# EAGLE design tdt_rereference (EAGLE 8.1.0)

## Sheet 1 of 2
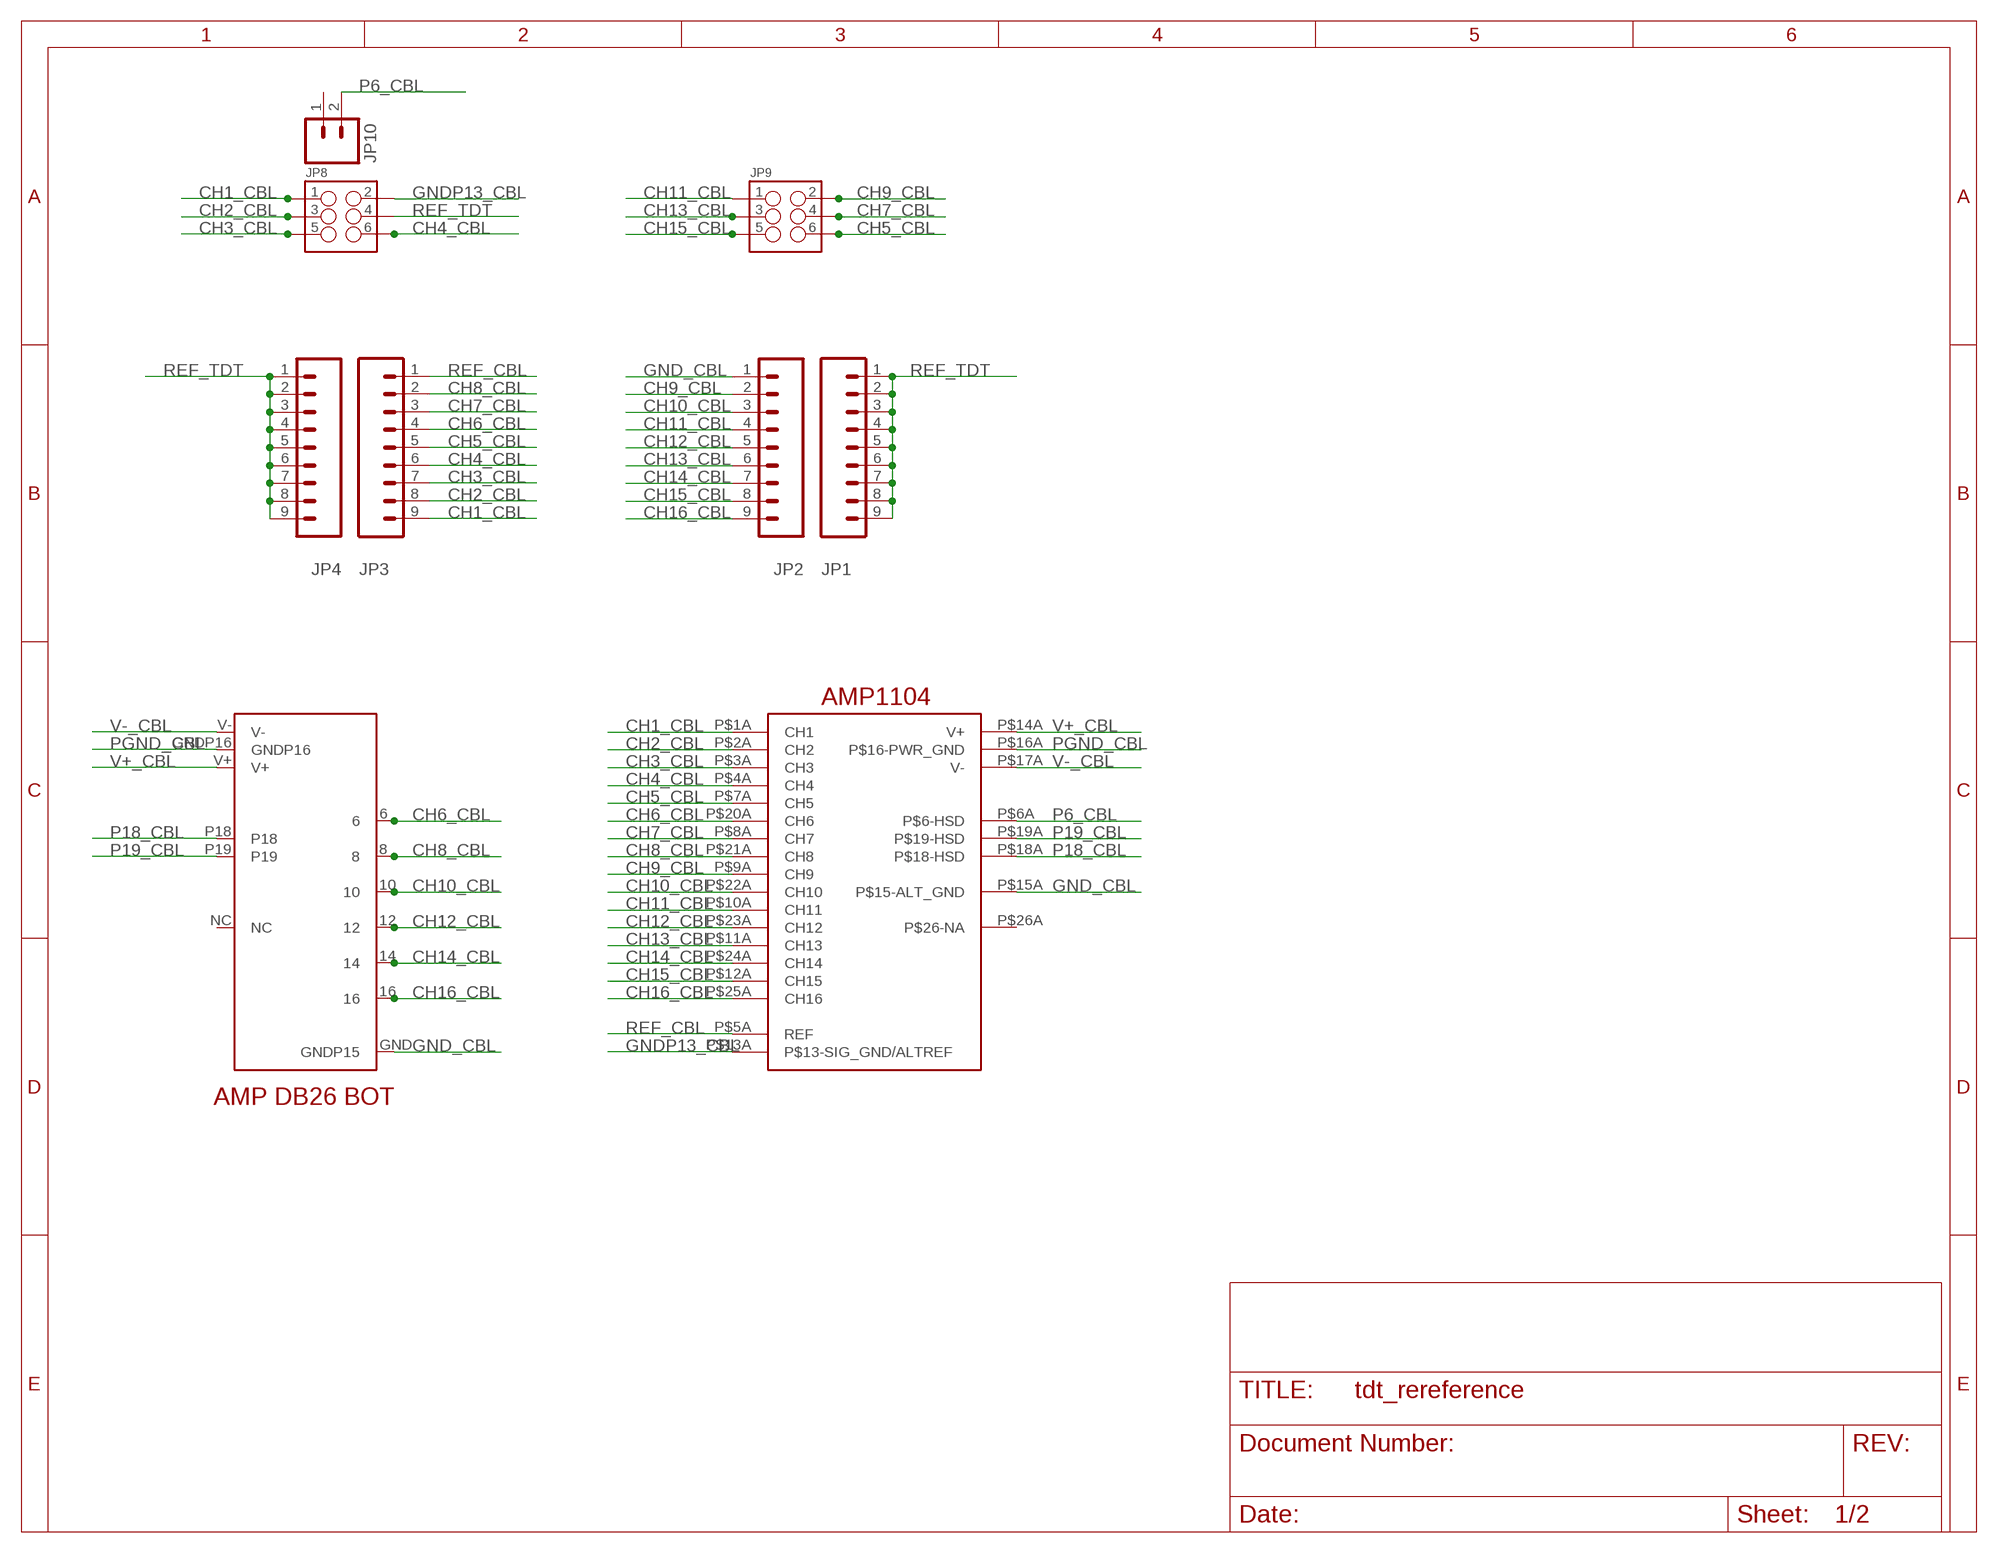
[diagram p0: schematic, sheet 1]

### Parts
JP1  M09  [1X09]
JP2  M09  [1X09]
JP3  M09  [1X09]
JP4  M09  [1X09]
JP8  M03X22X3_SILK_MALE_PTH  [2X3]
JP9  M03X22X3_SILK_MALE_PTH  [2X3]
JP10  M02PTH  [1X02]
U$1  DB26-MALE-BOT  [DB26-MALE-BOT]
U$3  AMP1104  [AMP1104]

### Nets
CH1_CBL: JP3.9 JP8.1 U$3.P$1A(CH1)
CH2_CBL: JP3.8 JP8.3 U$3.P$2A(CH2)
CH3_CBL: JP3.7 JP8.5 U$3.P$3A(CH3)
CH4_CBL: JP3.6 JP8.6 U$3.P$4A(CH4)
CH5_CBL: JP3.5 JP9.6 U$3.P$7A(CH5)
CH6_CBL: JP3.4 U$1.6 U$3.P$20A(CH6)
CH7_CBL: JP3.3 JP9.4 U$3.P$8A(CH7)
CH8_CBL: JP3.2 U$1.8 U$3.P$21A(CH8)
CH9_CBL: JP2.2 JP9.2 U$3.P$9A(CH9)
CH10_CBL: JP2.3 U$1.10 U$3.P$22A(CH10)
CH11_CBL: JP2.4 JP9.1 U$3.P$10A(CH11)
CH12_CBL: JP2.5 U$1.12 U$3.P$23A(CH12)
CH13_CBL: JP2.6 JP9.3 U$3.P$11A(CH13)
CH14_CBL: JP2.7 U$1.14 U$3.P$24A(CH14)
CH15_CBL: JP2.8 JP9.5 U$3.P$12A(CH15)
CH16_CBL: JP2.9 U$1.16 U$3.P$25A(CH16)
GND_CBL: JP2.1 U$1.GND(GNDP15) U$3.P$15A(P$15-ALT_GND)
GNDP13_CBL: JP8.2 U$3.P$13A(P$13-SIG_GND/ALTREF)
P6_CBL: JP10.2 U$3.P$6A(P$6-HSD)
P18_CBL: U$1.P18 U$3.P$18A(P$18-HSD)
P19_CBL: U$1.P19 U$3.P$19A(P$19-HSD)
PGND_CBL: U$1.GNDP16 U$3.P$16A(P$16-PWR_GND)
REF_CBL: JP3.1 U$3.P$5A(REF)
REF_TDT: JP1.1 JP1.2 JP1.3 JP1.4 JP1.5 JP1.6 JP1.7 JP1.8 JP1.9 JP4.1 JP4.2 JP4.3 JP4.4 JP4.5 JP4.6 JP4.7 JP4.8 JP4.9 JP8.4
V+_CBL: U$1.V+ U$3.P$14A(V+)
V-_CBL: U$1.V- U$3.P$17A(V-)
Unconnected: JP10.1 U$1.NC U$3.P$26A(P$26-NA)

## Sheet 2 of 2
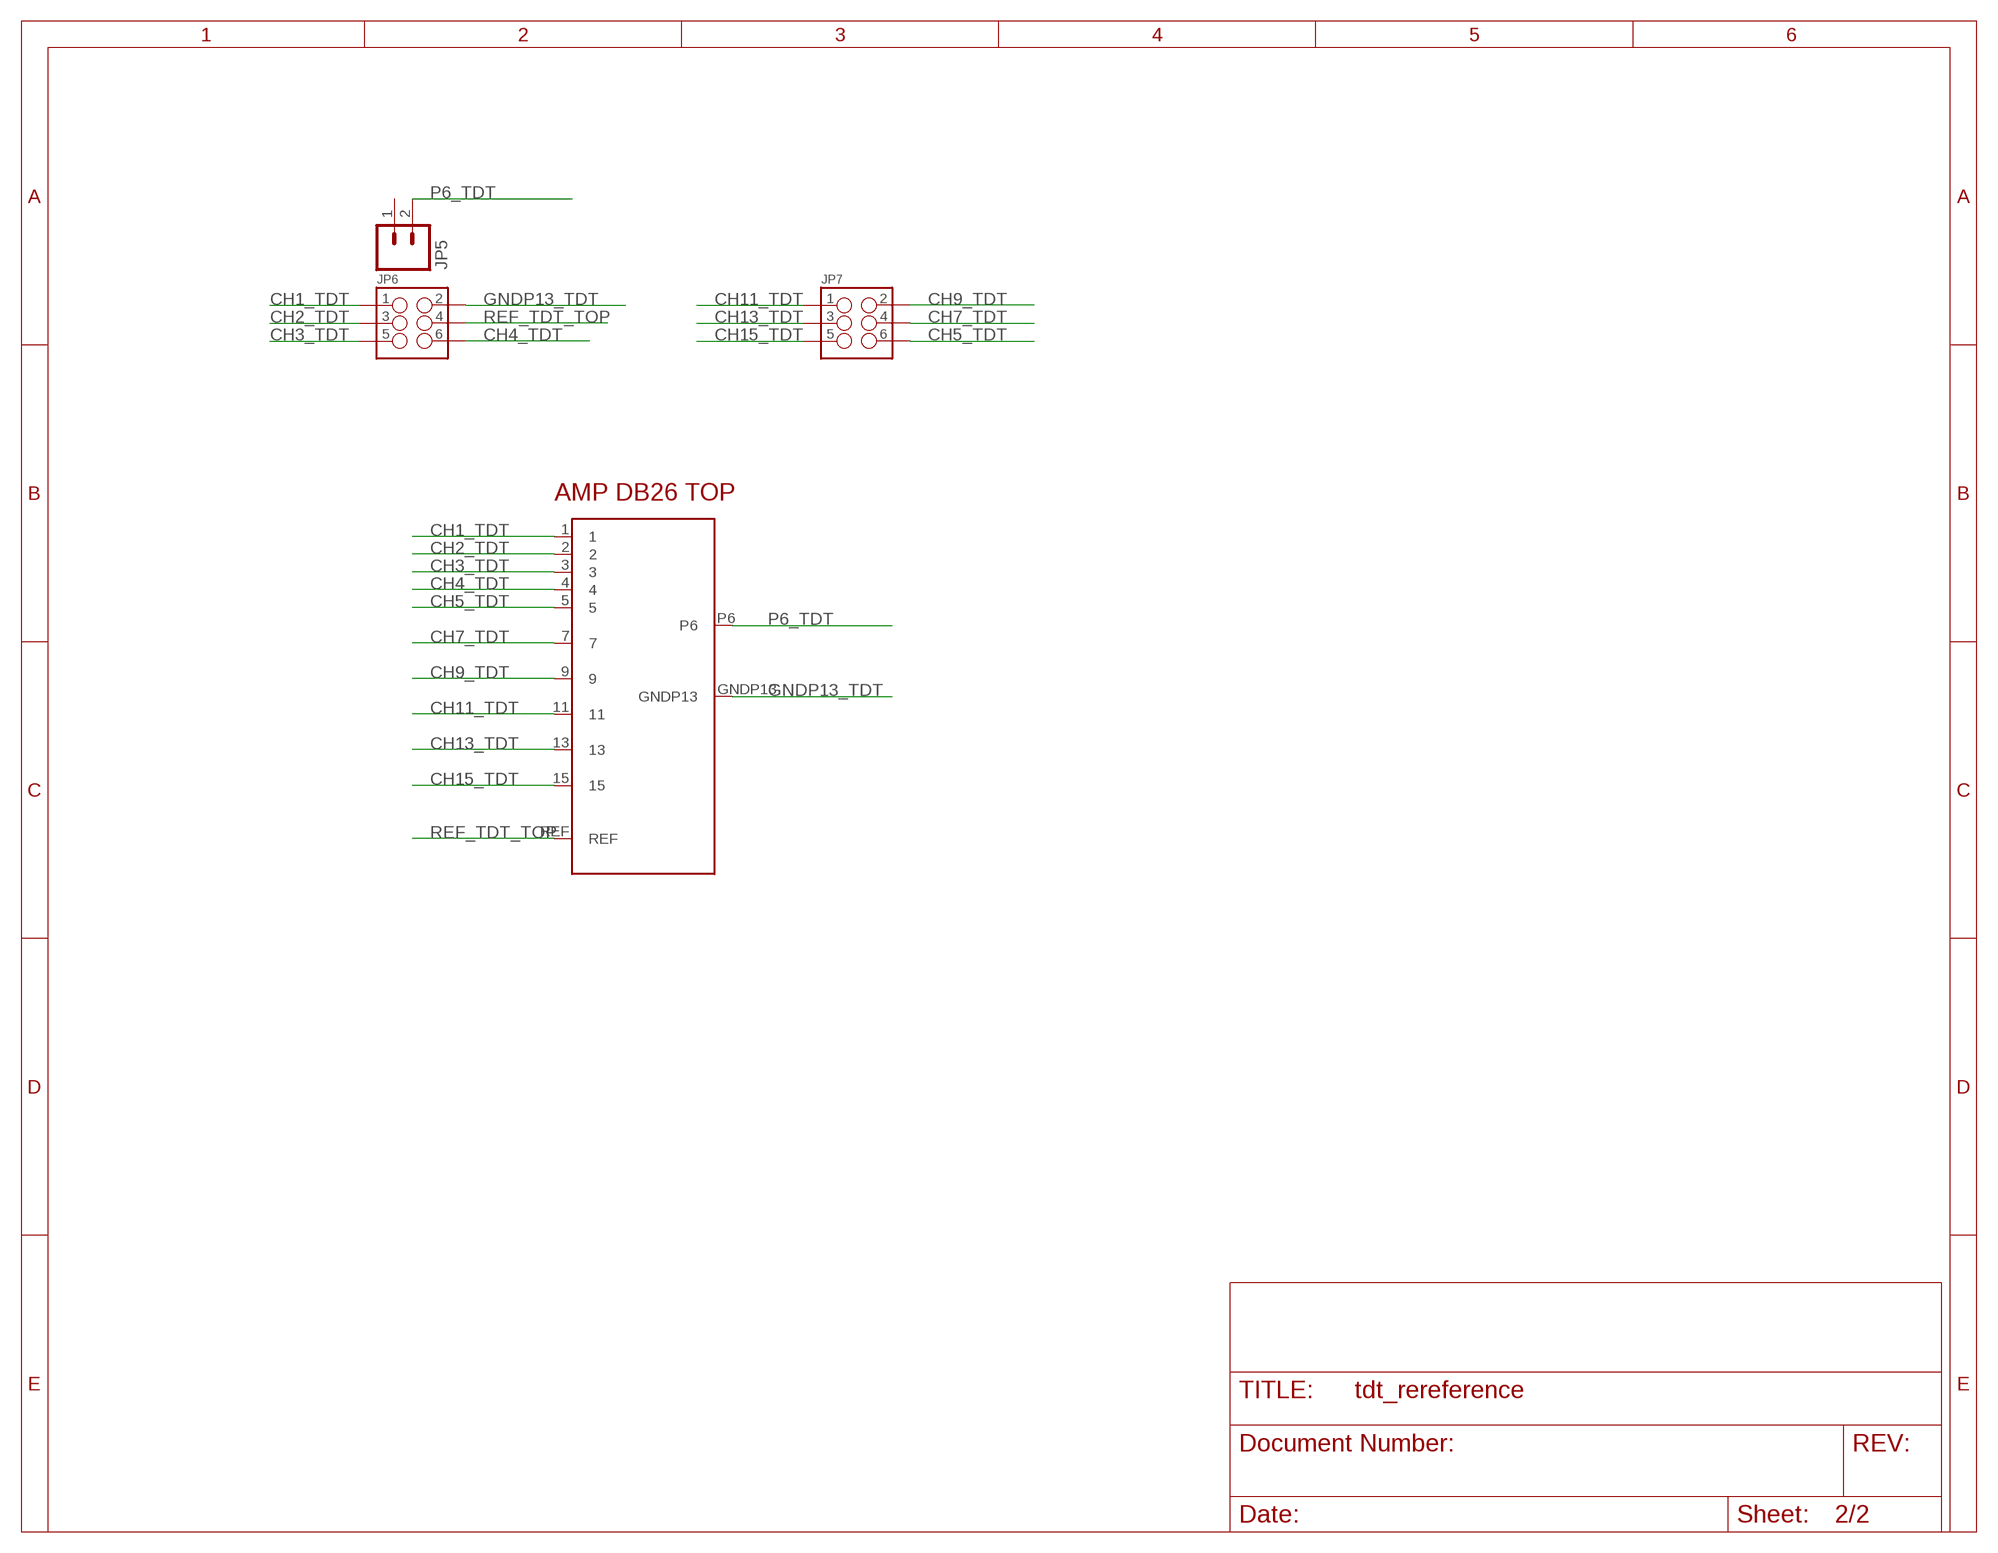
[diagram p1: schematic, sheet 2]

### Parts
JP5  M02PTH  [1X02]
JP6  M03X22X3_SILK_MALE_PTH  [2X3]
JP7  M03X22X3_SILK_MALE_PTH  [2X3]
U$2  DB26-MALE-TOP  [DB26-MALE-TOP]

### Nets
CH1_TDT: JP6.1 U$2.1
CH2_TDT: JP6.3 U$2.2
CH3_TDT: JP6.5 U$2.3
CH4_TDT: JP6.6 U$2.4
CH5_TDT: JP7.6 U$2.5
CH7_TDT: JP7.4 U$2.7
CH9_TDT: JP7.2 U$2.9
CH11_TDT: JP7.1 U$2.11
CH13_TDT: JP7.3 U$2.13
CH15_TDT: JP7.5 U$2.15
GNDP13_TDT: JP6.2 U$2.GNDP13
P6_TDT: JP5.2 U$2.P6
REF_TDT_TOP: JP6.4 U$2.REF
Unconnected: JP5.1

## Library data of the parts
JP1-JP4 = SparkFun-Connectors:M09: Header 9 Standard 9-pin 0.1" header. Use with straight break away headers (SKU : PRT-00116), right angle break away headers (PRT-00553), swiss pins (PRT-00743), machine pins (PRT-00117), and female headers (PRT-00115).
JP5 JP10 = SparkFun-Connectors:M02: Standard 2-pin 0.1" header. Use with - straight break away headers ( PRT-00116) - right angle break away headers (PRT-00553) - swiss pins (PRT-00743) - machine pins (PRT-00117) - female headers (PRT-00115) Molex polarized connector foot print use with: PRT-08233 with associated crimp pins and housings. 2.54_SCREWTERM for use with PRT-10571. 3.5mm Screw Terminal footprints for PRT-08084 5mm Screw Terminal footprints for use with PRT-08432
JP6-JP9 = SparkFun-Connectors:M03X2: 2x3 .1" header. Shrouded, with keying- CONN-10681 SMT- CONN-11415 Pogo pins- HW-11044; PROD_ID: CONN-09701
U$1 = HDMI-DB26:DB26-MALE-BOT
U$2 = HDMI-DB26:DB26-MALE-TOP
U$3 = TDTCableConnector:AMP1104

## Board
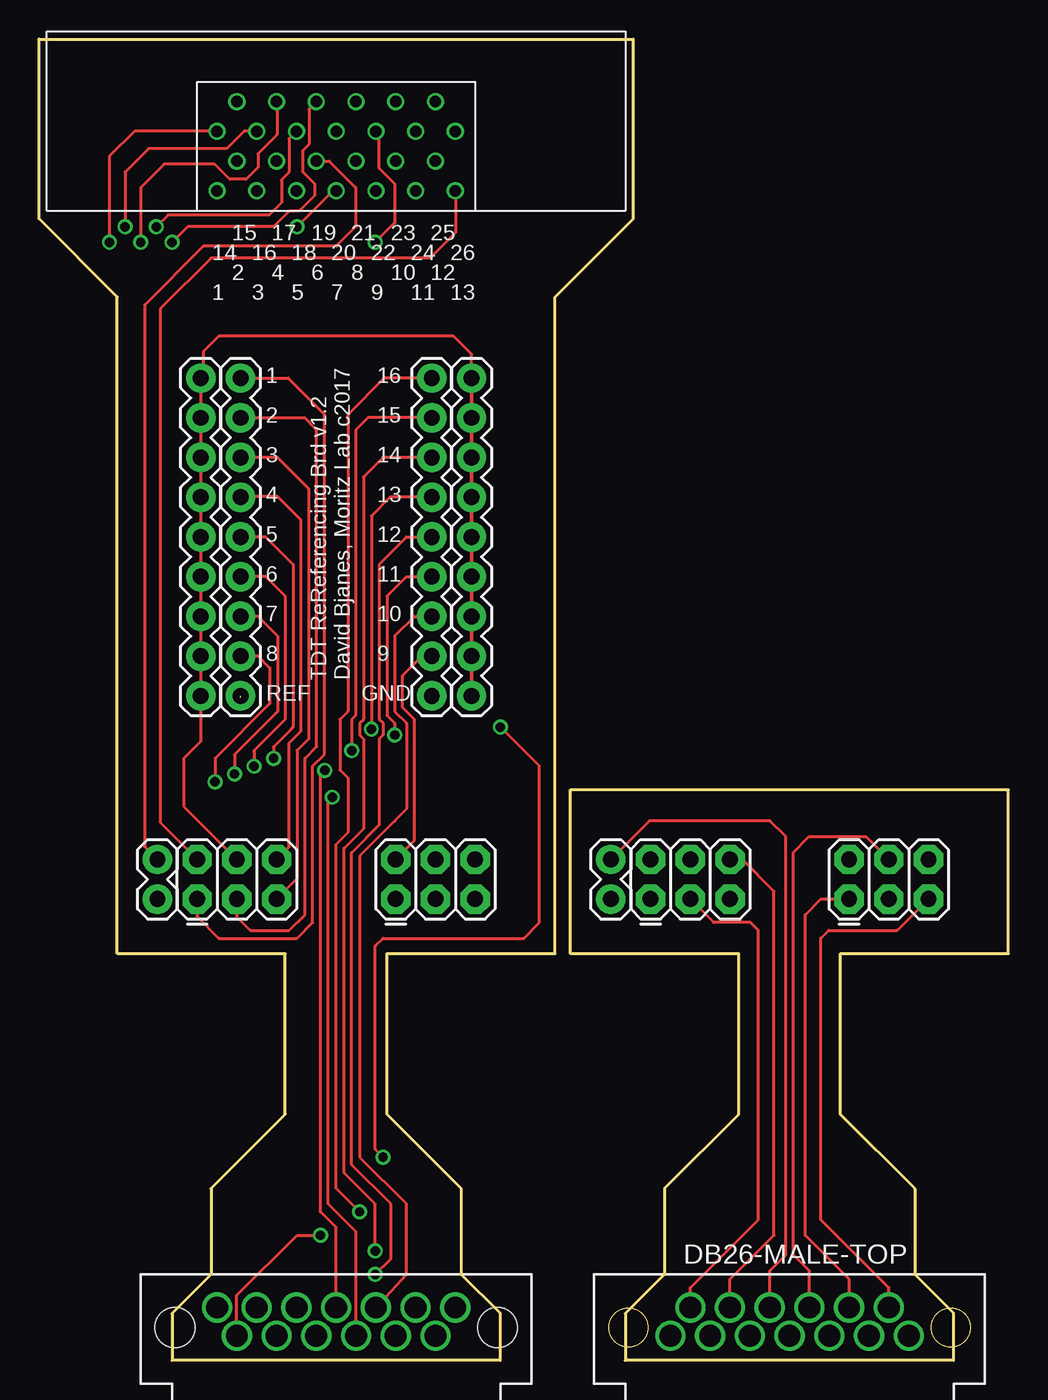
[diagram p2: board, top side]
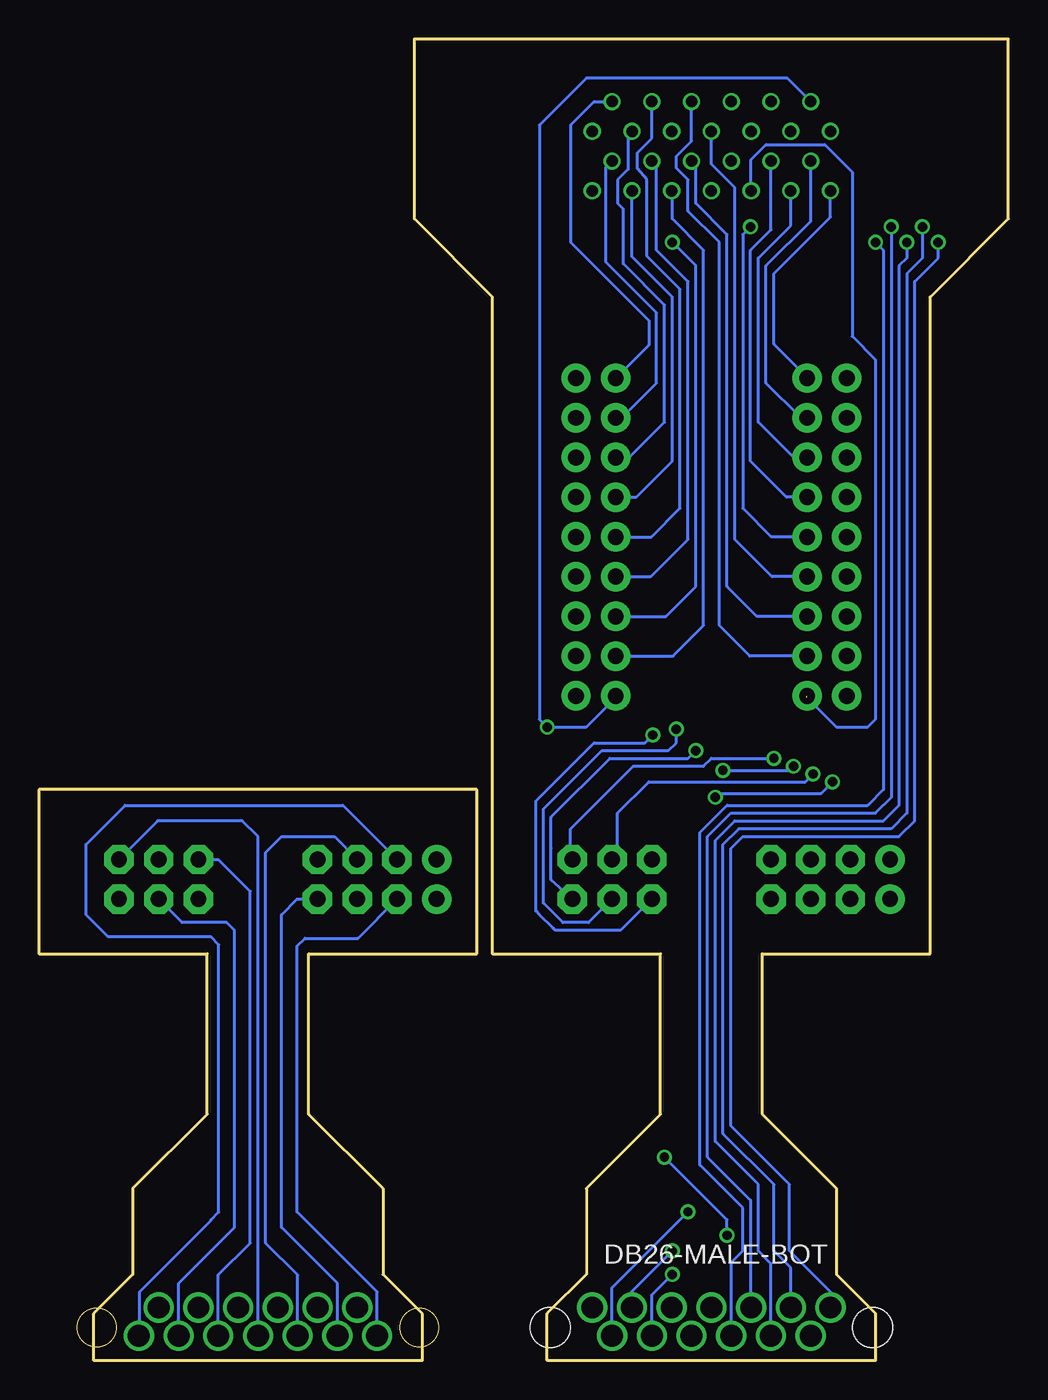
[diagram p3: board, bottom side, seen from below]

Size 62 x 84.5 mm. Coordinates in mm from the lower left corner, seen from the top.
Outline: 33,26 33,68 38,73 38,84.5 0,84.5 0,73 5,68 5,26 15.75,26 15.75,15.75 11,11 11,5.5 8.5,3 8.5,0 29.5,0 29.5,3 27,5.5 27,11 22.25,15.75 22.25,26 33,26
Outline: 58.5,0 37.5,0 37.5,3 40,5.5 40,11 44.75,15.75 44.75,26 34,26 34,36.5 62,36.5 62,26 51.25,26 51.25,15.75 56,11 56,5.5 58.5,3 58.5,0
Copper layers (1*16): Top 0.0356mm / dielectric 1.5011mm / Bottom 0.0356mm
Design rules "oshpark-2layer *": minimum track width 6mil, minimum drill 13mil, track to track 6mil, track to pad 6mil, pad to pad 6mil, via to via 6mil, smd to smd 6mil, copper to edge 15mil, drill to drill 6mil, minimum pad ring 7mil, minimum via ring 7mil, stop-mask expansion 2.5mil, vias tented up to drill 0mil, thermal gap 10mil

### Footprints (pad centres in the part's own frame; a part is rotated, then mirrored left to right if it is on the bottom)
1X09 = drill 1.016 pad 1.88: 1 0,0; 2 2.54,0; 3 5.08,0; 4 7.62,0; 5 10.16,0; 6 12.7,0; 7 15.24,0; 8 17.78,0; 9 20.32,0
1X02 = drill 1.016 pad 1.88: 1 0,0; 2 2.54,0
2X3 = drill 1.016 pad 1.88 octagon: 1 0,0; 2 0,2.54; 3 2.54,0; 4 2.54,2.54; 5 5.08,0; 6 5.08,2.54
DB26-MALE-BOT = drill 1.4 pad 1.93: 6 0,2.12; 8 -1.27,3.92; 10 -2.54,2.12; 12 -3.81,3.92; 14 -5.08,2.12; 16 -6.35,3.92; GND 6.35,3.92; GNDP16 5.08,2.12; NC -7.62,2.12; P18 2.54,2.12; P19 1.27,3.92; V+ 7.62,2.12; V- 3.81,3.92 | hole 2.54: 10.316,3.394; -10.316,3.394
DB26-MALE-TOP = drill 1.4 pad 1.93: 1 7.62,3.92; 2 6.35,2.12; 3 5.08,3.92; 4 3.81,2.12; 5 0,3.92; 7 -1.27,2.12; 9 -2.54,3.92; 11 -3.81,2.12; 13 -5.08,3.92; 15 -6.35,2.12; GNDP13 -7.62,3.92; P6 1.27,2.12; REF 2.54,3.92
AMP1104 = drill 0.737 pad 1.092: P$1A -7.62,-5.7; P$2A -6.35,-3.8; P$3A -5.08,-5.7; P$4A -3.81,-3.8; P$5A -2.54,-5.7; P$6A -1.27,-3.8; P$7A 0,-5.7; P$8A 1.27,-3.8; P$9A 2.54,-5.7; P$10A 3.81,-3.8; P$11A 5.08,-5.7; P$12A 6.35,-3.8; P$13A 7.62,-5.7; P$14A -7.62,-1.9; P$15A -6.35,0; P$16A -5.08,-1.9; P$17A -3.81,0; P$18A -2.54,-1.9; P$19A -1.27,0; P$20A 0,-1.9; P$21A 1.27,0; P$22A 2.54,-1.9; P$23A 3.81,0; P$24A 5.08,-1.9; P$25A 6.35,0; P$26A 7.62,-1.9

### Placement (x,y rotation side)
JP1  27.66,42.5 90 top
JP2  25.12,42.5 90 top
JP3  12.88,42.5 90 top
JP4  10.34,42.5 90 top
JP5  36.57,29.5 90 top
JP6  39.11,29.5 0 top
JP7  51.81,29.5 0 top
JP8  10.11,29.5 0 top
JP9  22.81,29.5 0 top
JP10  7.57,29.5 90 top
U$1  19,5.5 180 top
U$2  48,5.5 180 top
U$3  19,80.5 0 top

### Tracks (layer width: path | path; a pad name or v marks a point on that pad's centre or on a via)
CH1_CBL
  Top 0.203: JP3.9 15.93,62.82 18.25,60.5 18.25,38.75 17.5,38 17.5,28 16.5,27 11.5,27 10.11,28.39 JP8.1
  Bottom 0.203: JP3.9 12.82,62.82 15,65 15,69.5 11.38,73.12 U$3.P$1A
CH1_TDT
  Bottom 0.203: U$2.1 40.38,4.38 45.5,9.5 45.5,26.5 45,27 41.61,27 JP6.1
CH2_CBL
  Top 0.203: JP3.8 16.97,60.28 17.75,59.5 17.75,39.25 17,38.5 17,28.5 16,27.5 13.5,27.5 12.65,28.35 JP8.3
  Bottom 0.203: JP3.8 13.28,60.28 15.5,62.5 15.5,70 12.65,72.85 U$3.P$2A
CH2_TDT
  Top 0.203: U$2.2 41.65,4.65 46,9 46,27.5 45.5,28 43.15,28 JP6.3
CH3_CBL
  Top 0.203: JP3.7 15.25,57.75 17.25,55.75 17.25,39.76 16.5,39.01 16.5,30.81 JP8.5
  Bottom 0.203: JP3.7 13.74,57.74 16,60 16,70.5 13.92,72.58 U$3.P$3A
CH3_TDT
  Bottom 0.203: U$2.3 42.92,4.92 46.5,8.5 46.5,28.5 45.5,29.5 JP6.5
CH4_CBL
  Top 0.203: JP3.6 12.93,55.25 15.25,55.25 16.75,53.75 16.75,40.25 16,39.5 16,32.85 JP8.6
  Bottom 0.203: JP3.6 14.2,55.2 16.5,57.5 16.5,71 15.19,72.31 U$3.P$4A
CH4_TDT
  Top 0.203: U$2.4 44.19,5.19 47,8 47,30 45,32 44.23,32 JP6.6
CH5_CBL  (via drill 0.6)
  Top 0.203: U$3.P$7A 18.8,74.8 v16.5,72.5 | JP3.5 14.5,52.66 16.25,50.91 16.25,40.5 16.11,40.36 16.11,40.35 15,39.24 v15,38.5
  Bottom 0.203: JP3.5 15.16,52.66 17,54.5 17,72 v16.5,72.5 | JP9.6 28,32.15 28,34 24,38 19.5,38 19,38.5 v15,38.5
CH5_TDT
  Bottom 0.203: JP7.6 54.43,34.5 49,34.5 48,33.5 U$2.5
CH6_CBL  (via drill 0.6)
  Top 0.203: U$1.6 19,8.5 18,9.5 18,37.5 18.04,37.5 v18.27,37.73 | JP3.4 14.5,50.12 15.75,48.87 15.75,41 15.61,40.86 15.61,40.85 13.75,38.99 v13.75,38
  Bottom 0.203: JP3.4 15.12,50.12 17.5,52.5 17.5,75 19,76.5 U$3.P$20A | v18.27,37.73 13.98,37.73 v13.75,38
CH7_CBL  (via drill 0.6)
  Top 0.203: JP3.3 14,47.58 15.25,46.33 15.25,41.5 15.11,41.36 15.11,41.35 12.5,38.75 v12.5,37.5
  Bottom 0.203: JP3.3 16.08,47.58 18,49.5 18,72 20,74 20,76.43 U$3.P$8A | JP9.4 25,32.39 25,35 23,37 13,37 v12.5,37.5
CH7_TDT
  Top 0.203: U$2.7 49.27,5.73 48.25,6.75 48.25,32.5 49.25,33.5 52.89,33.5 JP7.4
CH8_CBL  (via drill 0.6)
  Top 0.203: U$1.8 20.27,8.23 18.5,10 18.5,35.77 v18.75,36.02 | JP3.2 14,45.04 14.75,44.29 14.75,42 11.25,38.5 v11.25,37
  Bottom 0.203: JP3.2 16.54,45.04 18.5,47 18.5,71.5 20.5,73.5 20.5,75.5 21.25,76.25 21.25,77 20.27,77.98 U$3.P$21A | v18.75,36.02 18.52,36.25 18.5,36.25 11.98,36.27 v11.25,37
CH9_CBL
  Top 0.203: JP2.2 24.5,45.04 23.25,43.79 23.25,41.75 24,41 24,33.25 23.5,32.75 23.25,32.48 JP9.2
  Bottom 0.203: JP2.2 21.46,45.04 19.5,47 19.5,71 21.5,73 21.5,74.76 U$3.P$9A
CH9_TDT
  Bottom 0.203: U$2.9 50.54,5.46 48.5,7.5 48.5,30 50.5,32 51.77,32 JP7.2
CH10_CBL  (via drill 0.6)
  Top 0.203: U$3.P$22A 21.75,78.39 21.75,76.25 22.75,75.25 22.75,72.75 v21.5,71.5 | JP2.3 24,47.58 22.75,46.33 22.75,41.5 23.5,40.75 23.5,35.25 22.75,34.5 22.75,34.49 20.5,32.25 20.5,13 23.5,10 23.5,5.5 U$1.10
  Bottom 0.203: JP2.3 21.92,47.58 20,49.5 20,70 v21.5,71.5
CH11_CBL  (via drill 0.6)
  Top 0.203: JP2.4 23.5,50.12 22.25,48.87 22.25,41.25 22.75,40.75 v22.75,40
  Bottom 0.203: JP2.4 22.88,50.12 20.5,52.5 20.5,69 22.5,71 22.5,76.39 U$3.P$10A | JP9.1 24.81,27.5 29,27.5 29.14,27.64 29.15,27.64 29.98,28.48 30.23,28.73 30.23,35.77 27.35,38.64 | 27.35,38.64 26.98,39.02 | 27.35,38.64 26.5,39.5 23.25,39.5 v22.75,40
CH11_TDT
  Top 0.203: U$2.11 51.81,5.19 49,8 49,28.5 50,29.5 JP7.1
CH12_CBL  (via drill 0.6)
  Top 0.203: JP2.5 23.5,52.66 21.75,50.91 21.75,41 22,40.75 22,40 21.75,39.75 21.75,34.25 20,32.5 20,12.5 22.5,10 22.5,6.5 v21.5,5.5
  Bottom 0.203: JP2.5 22.84,52.66 21,54.5 21,68.5 23.12,70.62 23.12,75.5 23.72,76.22 23.72,77.25 22.81,78.16 U$3.P$23A | U$1.12 22.81,4.19 v21.5,5.5
CH13_CBL  (via drill 0.6)
  Top 0.203: JP2.6 22.45,55.2 21.25,54 v21.25,40.38
  Bottom 0.203: JP2.6 23.8,55.2 21.5,57.5 21.5,68 24.08,70.58 U$3.P$11A | JP9.3 26.85,28 28.5,28 29.75,29.25 29.75,33.25 29.75,35.25 26,39 21.75,39 21.25,39.5 v21.25,40.38
CH13_TDT
  Bottom 0.203: U$2.13 53.08,4.92 49.5,8.5 49.5,27.5 50,28 52.85,28 JP7.3
CH14_CBL  (via drill 0.6)
  Top 0.203: JP2.7 21.99,57.74 20.75,56.5 20.75,41 20.5,40.75 20.5,40 20.75,39.75 20.75,34 19.5,32.75 19.5,12 21.5,10 v21.5,7
  Bottom 0.203: JP2.7 24.26,57.74 22,60 22,67.5 24.62,70.12 24.62,73.62 25,74 25,75.5 24.33,76.17 24.33,78.4 24.08,78.65 U$3.P$24A | U$1.14 24.08,4.42 v21.5,7
CH15_CBL  (via drill 0.6)
  Top 0.203: JP2.8 21.03,60.28 20.25,59.5 20.25,41.25 20,41 v20,39
  Bottom 0.203: JP2.8 24.72,60.28 22.5,62.5 22.5,67 25.75,70.25 25.75,76.3 U$3.P$12A | JP9.5 29.25,30.73 29.25,32.75 29.25,34.75 25.5,38.5 20.5,38.5 v20,39
CH15_TDT
  Top 0.203: U$2.15 54.35,4.65 50,9 50,27 50.5,27.5 54.89,27.5 JP7.5
CH16_CBL  (via drill 0.6)
  Top 0.203: JP2.9 22.07,62.82 19.75,60.5 19.75,41.5 19.25,41 19.25,37.75 19.75,37.25 19.75,33.75 19,33 19,11 v20.5,9.5
  Bottom 0.203: U$3.P$25A 26.5,80.5 28,79 28,71.5 23,66.5 23,64.94 JP2.9 | U$1.16 25.35,4.65 v20.5,9.5
GND_CBL  (via drill 0.6)
  Top 0.203: v29.5,40.5 32,38 32,28 31,27 22,27 21.5,26.5 21.5,13.5 v22,13 | U$1.GND 12.65,4.15 16.5,8 v18,8
  Bottom 0.203: U$3.P$15A 14.15,82 27,82 30,79 30,41 v29.5,40.5 27,40.5 25.12,42.38 JP2.1 | v18,8 18,9 v22,13
GNDP13_CBL
  Top 0.203: U$3.P$13A 26.62,72.12 25,70.5 11,70.5 7.75,67.25 7.75,34.4 JP8.2
GNDP13_TDT
  Bottom 0.203: U$2.GNDP13 55.57,1.63 55.57,4.38 51,8.95 51,9 50.5,9.5 50.5,26.58 51.01,27.08 57.58,27.08 59,28.5 59,33 56.5,35.5 42.57,35.5 JP6.2
P6_CBL
  Top 0.203: U$3.P$6A 18.55,76.7 20.25,75 20.25,72.5 19,71.25 10.5,71.25 6.75,67.5 6.75,32.86 JP10.2
P6_TDT
  Top 0.203: U$2.P6 46.73,5.73 47.75,6.75 47.75,33.5 46.75,34.5 39.03,34.5 JP5.2
P18_CBL  (via drill 0.6)  (1 unrouted)
  Top 0.203: U$3.P$18A 15.99,78.13 15.99,75.99 15.5,75.5 15.5,74.03 14.72,73.25 8.25,73.25 v7.5,72.5
  Bottom 0.203: 19.25,33.51 19.25,13 16.5,10.25 16.5,3.42 U$1.P18 | 19.25,33.5 17.75,35 8.5,35 7.5,36 v7.5,72.5
P19_CBL  (via drill 0.6)
  Top 0.203: U$3.P$19A 17.26,80.03 17.26,77.77 16.85,77.35 16.85,76.03 17.62,75.25 17.62,74.5 16.62,73.5 16,73.5 15,72.5 9.5,72.5 v8.5,71.5
  Bottom 0.203: U$1.P19 17.73,6.27 17,7 17,9.75 19.75,12.5 19.75,33.76 19.74,33.76 18,35.5 9,35.5 8,36.5 8,71 v8.5,71.5
PGND_CBL  (via drill 0.6)
  Top 0.203: U$3.P$16A 13.1,78.6 12,77.5 7,77.5 5.5,76 v5.5,72.5
  Bottom 0.203: U$1.GNDP16 13.92,5.92 15,7 15,11.25 18.25,14.5 18.25,33 17.25,34 7.5,34 6.5,35 6.5,69.5 5.5,70.5 v5.5,72.5
REF_CBL  (1 unrouted)
  Bottom 0.203: 12.88,42.38 11,40.5 9,40.5 8.5,41 8.5,64 10,65.5 10,76 11.75,77.75 15.5,77.75 16.46,76.79 U$3.P$5A
REF_TDT
  Top 0.203: JP1.9 JP1.8 JP1.7 JP1.6 JP1.5 JP1.4 JP1.3 JP1.2 JP1.1 27.66,64.34 26.5,65.5 11.5,65.5 10.5,64.5 10.5,62.98 JP4.9 JP4.8 JP4.7 JP4.6 JP4.5 JP4.4 JP4.3 JP4.2 JP4.1 10.34,39.59 9.25,38.5 9.25,35.44 JP8.4
REF_TDT_TOP
  Bottom 0.203: U$2.REF 45.46,5.46 47.5,7.5 47.5,32.5 46.5,33.5 43.11,33.5 JP6.4
V+_CBL  (via drill 0.6)
  Top 0.203: U$3.P$14A 6.1,78.6 4.5,77 v4.5,71.5
  Bottom 0.203: U$1.V+ 11.38,4.38 14,7 14,11.25 17.75,15 17.75,32.75 17,33.5 7,33.5 6,34.5 6,69 4.5,70.5 v4.5,71.5
V-_CBL  (via drill 0.6)
  Top 0.203: U$3.P$17A 15.22,80.41 15.22,78.39 14,77.17 14,76.29 13.23,75.53 12.19,75.53 11.22,76.5 8,76.5 6.5,75 v6.5,71.5
  Bottom 0.203: U$1.V- 15.19,6.19 16,7 16,11.25 18.75,14 18.75,33.25 17.5,34.5 8,34.5 7,35.5 7,70.01 6.5,70.51 v6.5,71.5

### Text on the board
tPlace: 1 | 16 | 2 | 15 | 3 | 14 | 4 | 13 | 5 | 12 | 6 | 11 | 7 | 10 | 8 | 9 | REF | GND
tNames: TDT ReReferencing Brd v1.2 / David Bjanes, Moritz Lab c2017